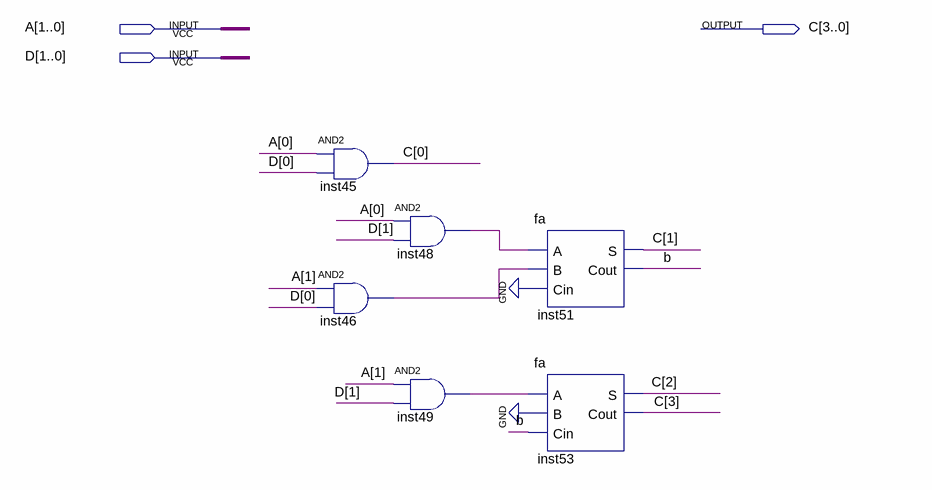
[diagram p0: schematic sheet]
// Quartus schematic mult2_4.bdf as structural Verilog: 6 symbols, 3 pins
module mult2_4 (
  input  [1:0] A,
  input  [1:0] D,
  output [3:0] C
);

  wire b, inst46_out, inst48_out, inst49_out;

  and inst45 (C[0], A[0], D[0]);
  and inst46 (inst46_out, A[1], D[0]);
  and inst48 (inst48_out, A[0], D[1]);
  and inst49 (inst49_out, A[1], D[1]);
  fa inst51 (.A(inst48_out), .B(inst46_out), .Cin(1'b0), .S(C[1]), .Cout(b));
  fa inst53 (.A(inst49_out), .B(1'b0), .Cin(b), .S(C[2]), .Cout(C[3]));
endmodule
